# Altium schematic sheet Revison Table.SchDoc: Titel
size A4 portrait; ApprovedBy: name; CompanyName: DCI Electronics bv; DrawnBy: KRS; Address1: Nijverheidsstraat 14; Address2: 4458 AV Eindewege; Address3: Phone: +31 (0)113 344880; DocumentNumber: 1; Revision: 1; SheetNumber: 1; SheetTotal: 14; PageSetup: Record=PageOptions|CenterHorizontal=True|CenterVertical=True|PrintScale=1.00|XCorrection=1.00|YCorrection=1.00|PrintKind=1|BorderSize=5000000|LeftOffset=0|BottomOffset=0|Orientation=2|PaperLength=1000|PaperWidth=1000|Scale=100|PaperSource=7|PrintQuality=-4|MediaType=1|DitherType=10|PaperKind=ISO_A4_(210.00_x_297.00_MM)|PrintScaleMode=1; SubTitle: SubTitel; ApprovedDate: 01-01-12
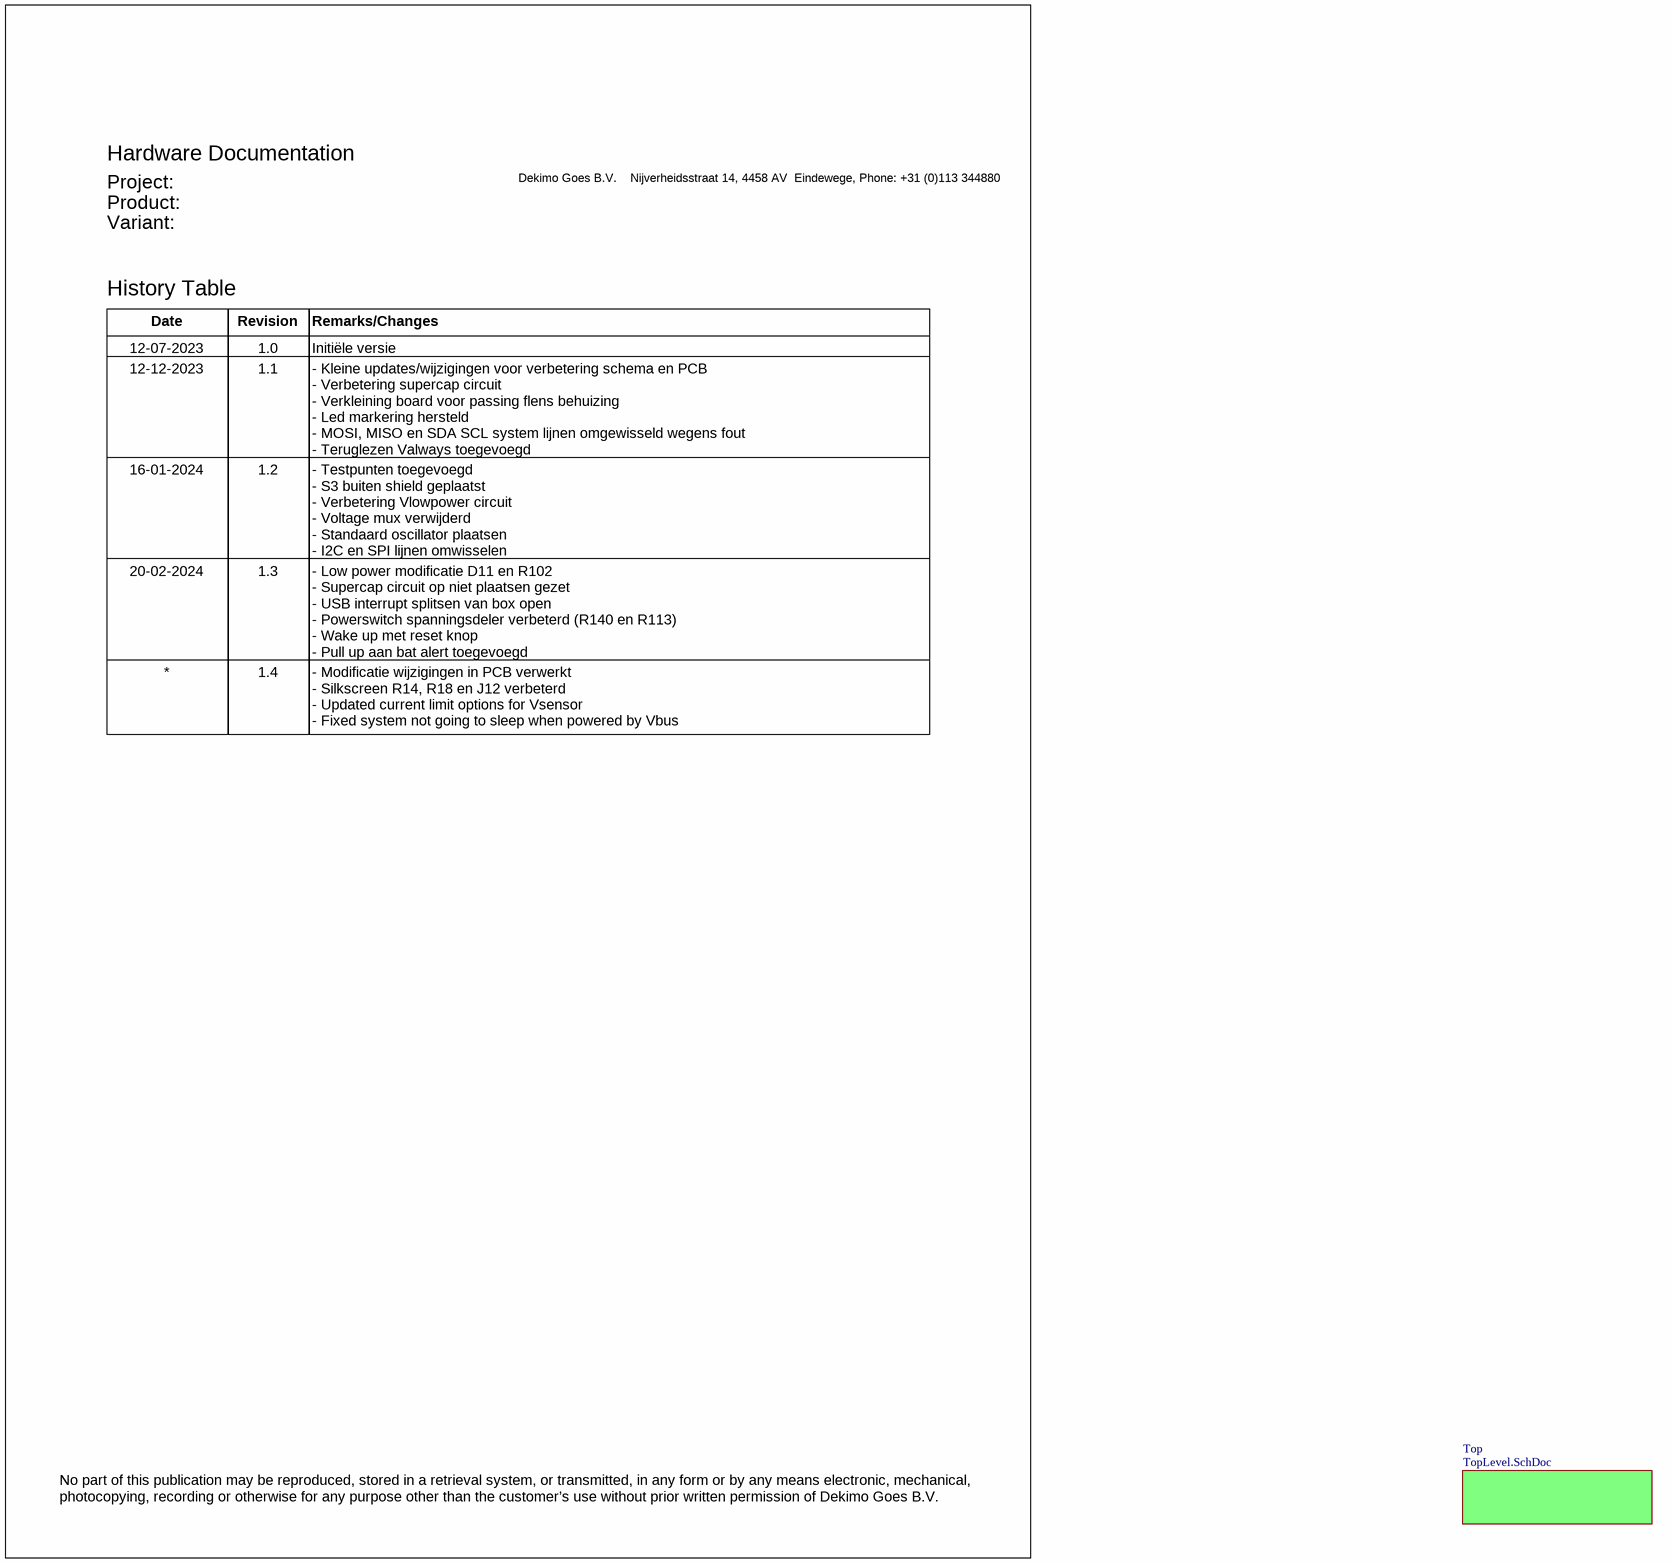
[diagram p0: Revison Table.SchDoc]

## Sub-sheets
Top = TopLevel.SchDoc: no entries

## Notes on the sheet
- 12-07-2023
- 1.0
- Initiële versie
- 12-12-2023
- 1.1
- - Kleine updates/wijzigingen voor verbetering schema en PCB
  - Verbetering supercap circuit
  - Verkleining board voor passing flens behuizing
  - Led markering hersteld
  - MOSI, MISO en SDA SCL system lijnen omgewisseld wegens fout
  - Teruglezen Valways toegevoegd
- 16-01-2024
- 1.2
- - Testpunten toegevoegd
  - S3 buiten shield geplaatst
  - Verbetering Vlowpower circuit
  - Voltage mux verwijderd
  - Standaard oscillator plaatsen
  - I2C en SPI lijnen omwisselen
- 20-02-2024
- 1.3
- - Low power modificatie D11 en R102
  - Supercap circuit op niet plaatsen gezet
  - USB interrupt splitsen van box open
  - Powerswitch spanningsdeler verbeterd (R140 en R113)
  - Wake up met reset knop
  - Pull up aan bat alert toegevoegd
- 1.4
- - Modificatie wijzigingen in PCB verwerkt
  - Silkscreen R14, R18 en J12 verbeterd
  - Updated current limit options for Vsensor
  - Fixed system not going to sleep when powered by Vbus
- Hardware Documentation
- Project:
- Product:
- Variant:
- Dekimo Goes B.V.
- Nijverheidsstraat 14, 4458 AV  Eindewege, Phone: +31 (0)113 344880
- History Table
- Date
- Revision
- Remarks/Changes
- No part of this publication may be reproduced, stored in a retrieval system, or transmitted, in any form or by any means electronic, mechanical, photocopying, recording or otherwise for any purpose other than the customer’s use without prior written permission of Dekimo Goes B.V.